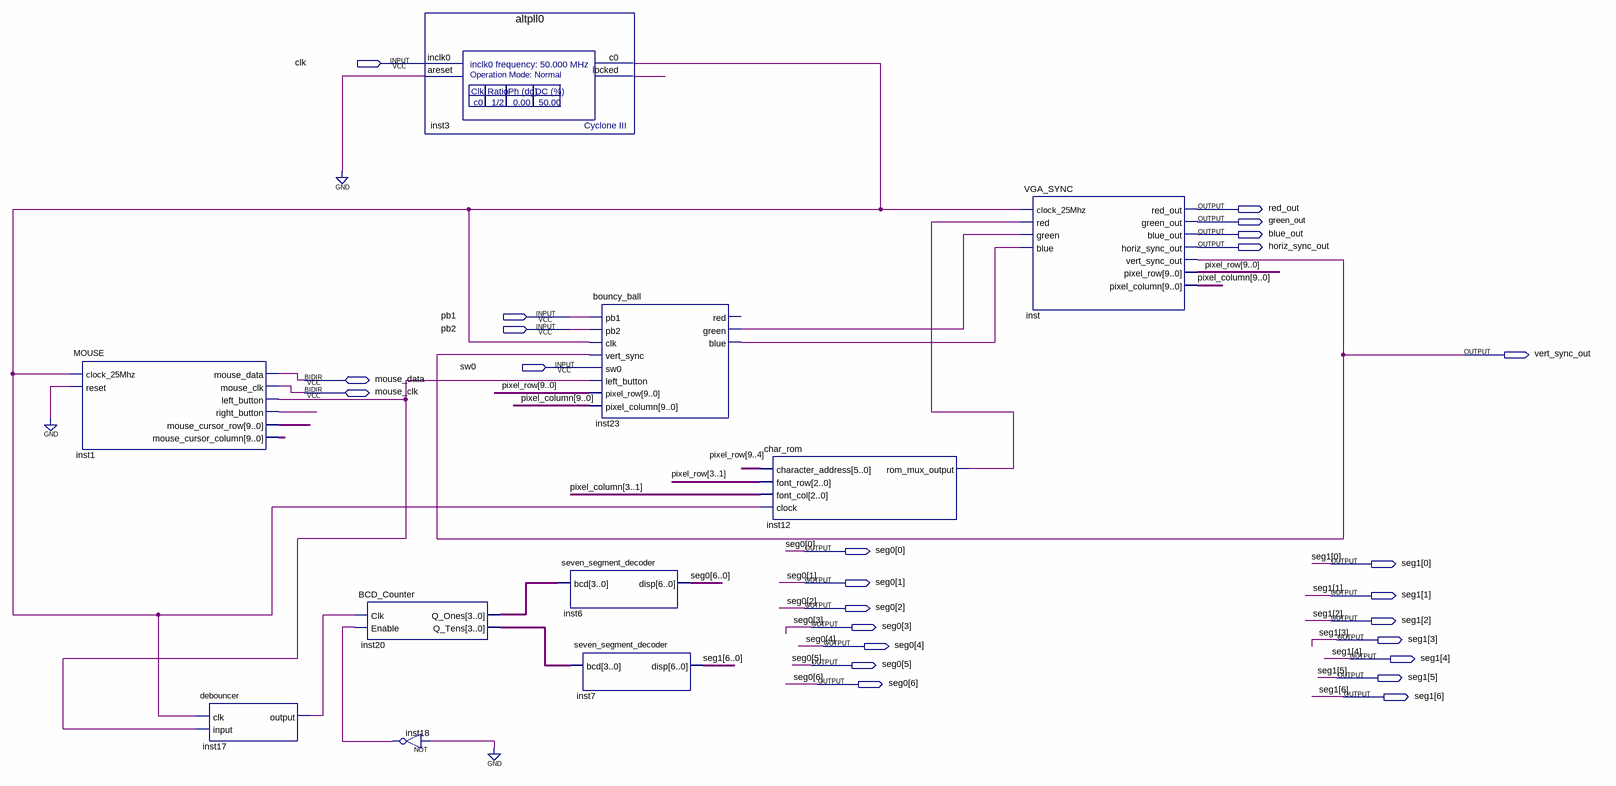
[diagram p0: schematic sheet]
// Quartus schematic VGAExample.bdf as structural Verilog: 10 symbols, 25 pins
module VGAExample (
  input  clk,
  input  pb1,
  input  pb2,
  input  sw0,
  inout  mouse_data,
  inout  mouse_clk,
  output red_out,
  output green_out,
  output blue_out,
  output horiz_sync_out,
  output vert_sync_out,
  output [6:0] seg0,
  output [6:0] seg1
);

  wire inst1_left_button, inst1_right_button, inst3_c0, inst3_locked, inst12_rom_mux_output, inst17_output,
       inst18_out, inst23_blue, inst23_green;
  wire [3:0] inst20_q_ones, inst20_q_tens;
  wire [9:0] inst1_mouse_cursor_column, inst1_mouse_cursor_row, pixel_column, pixel_row;

  MOUSE inst1 (
    .clock_25Mhz(inst3_c0), .reset(1'b0), .left_button(inst1_left_button), .right_button(inst1_right_button),
    .mouse_cursor_row(inst1_mouse_cursor_row), .mouse_cursor_column(inst1_mouse_cursor_column),
    .mouse_data(mouse_data), .mouse_clk(mouse_clk));
  debouncer inst17 (.clk(inst3_c0), .\input (inst1_left_button), .\output (inst17_output));
  BCD_Counter inst20 (.Clk(inst17_output), .Enable(inst18_out), .Q_Ones(inst20_q_ones), .Q_Tens(inst20_q_tens));
  not inst18 (inst18_out, 1'b0);
  altpll0 inst3 (.inclk0(clk), .areset(1'b0), .c0(inst3_c0), .locked(inst3_locked));
  seven_segment_decoder inst6 (.bcd(inst20_q_ones), .disp(seg0));
  bouncy_ball inst23 (
    .pb1(pb1), .pb2(pb2), .clk(inst3_c0), .vert_sync(vert_sync_out), .sw0(sw0),
    .left_button(inst1_left_button), .pixel_row(pixel_row), .pixel_column(pixel_column),
    .green(inst23_green), .blue(inst23_blue));  // open: red
  seven_segment_decoder inst7 (.bcd(inst20_q_tens), .disp(seg1));
  char_rom inst12 (
    .character_address(pixel_row[9:4]), .font_row(pixel_row[3:1]), .font_col(pixel_column[3:1]),
    .clock(inst3_c0), .rom_mux_output(inst12_rom_mux_output));
  VGA_SYNC inst (
    .clock_25Mhz(inst3_c0), .red(inst12_rom_mux_output), .green(inst23_green), .blue(inst23_blue),
    .red_out(red_out), .green_out(green_out), .blue_out(blue_out), .horiz_sync_out(horiz_sync_out),
    .vert_sync_out(vert_sync_out), .pixel_row(pixel_row), .pixel_column(pixel_column));
endmodule
